# EAGLE design ftdiusb (EAGLE 9.6.1)
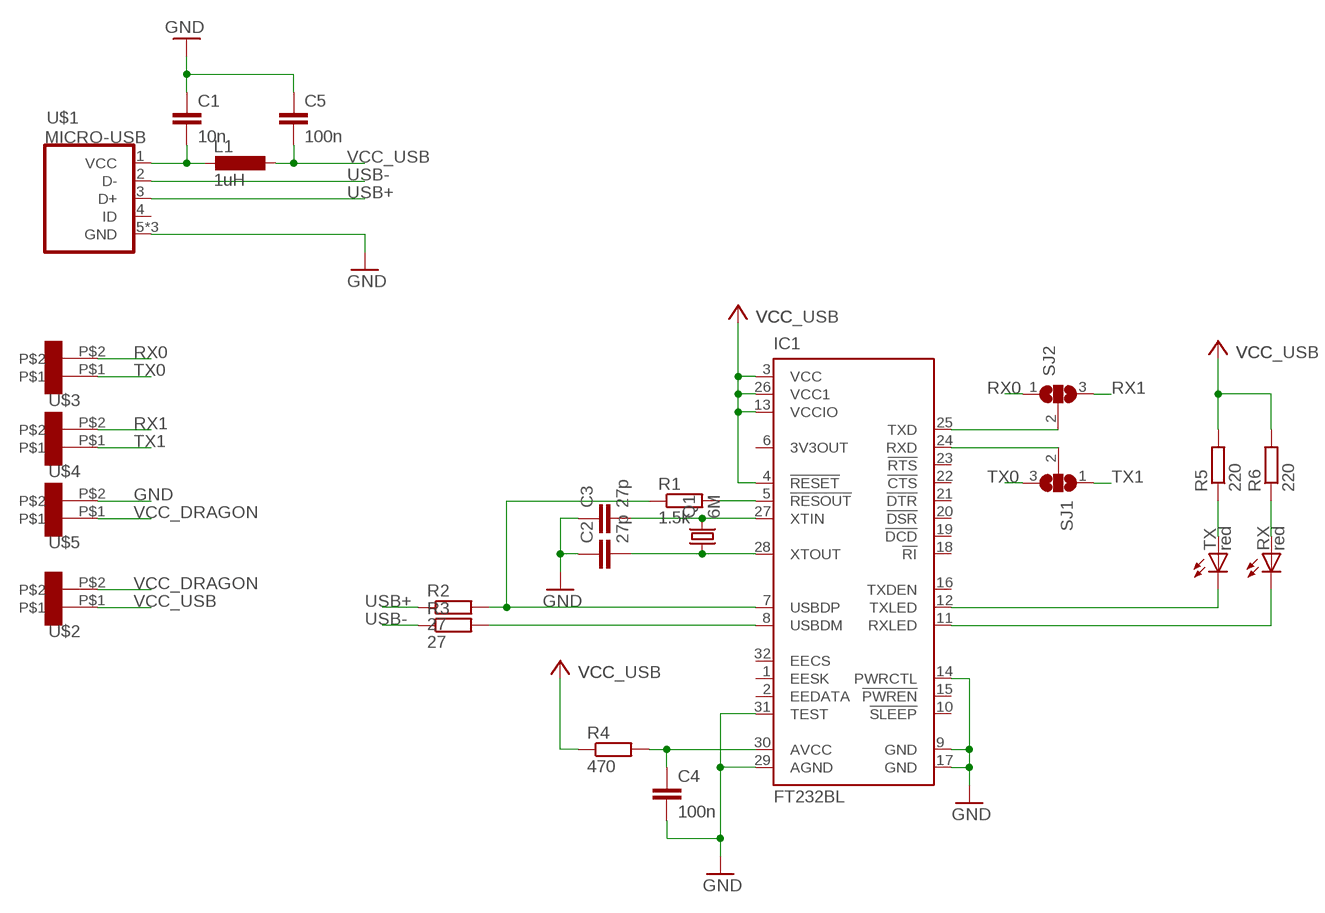
[diagram p0: schematic, sheet 1]

## Parts
C1  10n  C-EUC0603  [C0603]
C2  27p  C-EUC0603  [C0603]
C3  27p  C-EUC0603  [C0603]
C4  100n  C-EUC0603  [C0603]
C5  100n  C-EUC0603  [C0603]
IC1  FT232BL  [LQFP32-7X7]
L1  1uH  L-EUL0603  [L0603]
Q1  6M  CRYSTALHC49U-V  [HC49U-V]
R1  1.5k  R-EU_R0603  [R0603]
R2  27  R-EU_R0603  [R0603]
R3  27  R-EU_R0603  [R0603]
R4  470  R-EU_R0603  [R0603]
R5  220  R-EU_R0603  [R0603]
R6  220  R-EU_R0603  [R0603]
RX  red  LED_0603  [C0603]
SJ1  SJ2WW  [SJ_2W]
SJ2  SJ2WW  [SJ_2W]
TX  red  LED_0603  [C0603]
U$1  MICRO-USB  [MICRO-USB]
U$2  CON_DIL_2  [CON_DIL_2]
U$3  CON_DIL_2  [CON_DIL_2]
U$4  CON_DIL_2  [CON_DIL_2]
U$5  CON_DIL_2  [CON_DIL_2]

## Nets
GND: C1.1 C2.1 C3.1 C4.2 C5.1 IC1.9(GND) IC1.14(PWRCTL) IC1.17(GND) IC1.29(AGND) IC1.31(TEST) U$1.5(GND) U$1.GND1(GND) U$1.GND2(GND) U$5.P$2
N$1: IC1.5(!RESOUT) R1.2
N$2: IC1.7(USBDP) R1.1 R2.2
N$3: IC1.8(USBDM) R3.2
N$4: C1.2 L1.2 U$1.1(VCC)
N$5: IC1.25(TXD) SJ2.2
N$6: C3.2 IC1.27(XTIN) Q1.2
N$7: C2.2 IC1.28(XTOUT) Q1.1
N$8: IC1.24(RXD) SJ1.2
N$9: IC1.12(TXLED) TX.N
N$10: R5.1 TX.P
N$11: C4.1 IC1.30(AVCC) R4.2
N$12: R6.1 RX.P
N$13: IC1.11(RXLED) RX.N
RX0: SJ2.1 U$3.P$2
RX1: SJ2.3 U$4.P$2
TX0: SJ1.3 U$3.P$1
TX1: SJ1.1 U$4.P$1
USB+: R2.1 U$1.3(D+)
USB-: R3.1 U$1.2(D-)
VCC_DRAGON: U$2.P$2 U$5.P$1
VCC_USB: C5.2 IC1.3(VCC) IC1.4(!RESET) IC1.13(VCCIO) IC1.26(VCC1) L1.1 R4.1 R5.2 R6.2 U$2.P$1 ; supply symbol labelled VCC
Unconnected: IC1.1(EESK) IC1.2(EEDATA) IC1.6(3V3OUT) IC1.10(!SLEEP) IC1.15(!PWREN) IC1.16(TXDEN) IC1.18(!RI) IC1.19(!DCD) IC1.20(!DSR) IC1.21(!DTR) IC1.22(!CTS) IC1.23(!RTS) IC1.32(EECS) U$1.4(ID)

## Library data of the parts
C1-C5 = rcl:C-EU: CAPACITOR, European symbol; SPICEPREFIX: C
IC1 = ftdichip:FT232B: USB to serial UART interface Source: DS_FT232BL_BQ.pdf; MF: FARNELL; MPN: FT232BL/TR; OC_FARNELL: unknown; OC_NEWARK: 38K1551
L1 = rcl-2:L-EU: INDUCTOR, European symbol
Q1 = crystal:CRYSTAL: CRYSTAL; OC_FARNELL: 1666969; OC_NEWARK: unknown
R1-R6 = rcl:R-EU_: RESISTOR, European symbol; SPICEPREFIX: R
RX TX = led:LED_0603
SJ1 SJ2 = jumper:SJ2W: SMD solder JUMPER
U$1 = microusb:MICRO-USB: Micro USB B connector
U$2-U$5 = connector:CON_DIL_2

## Board
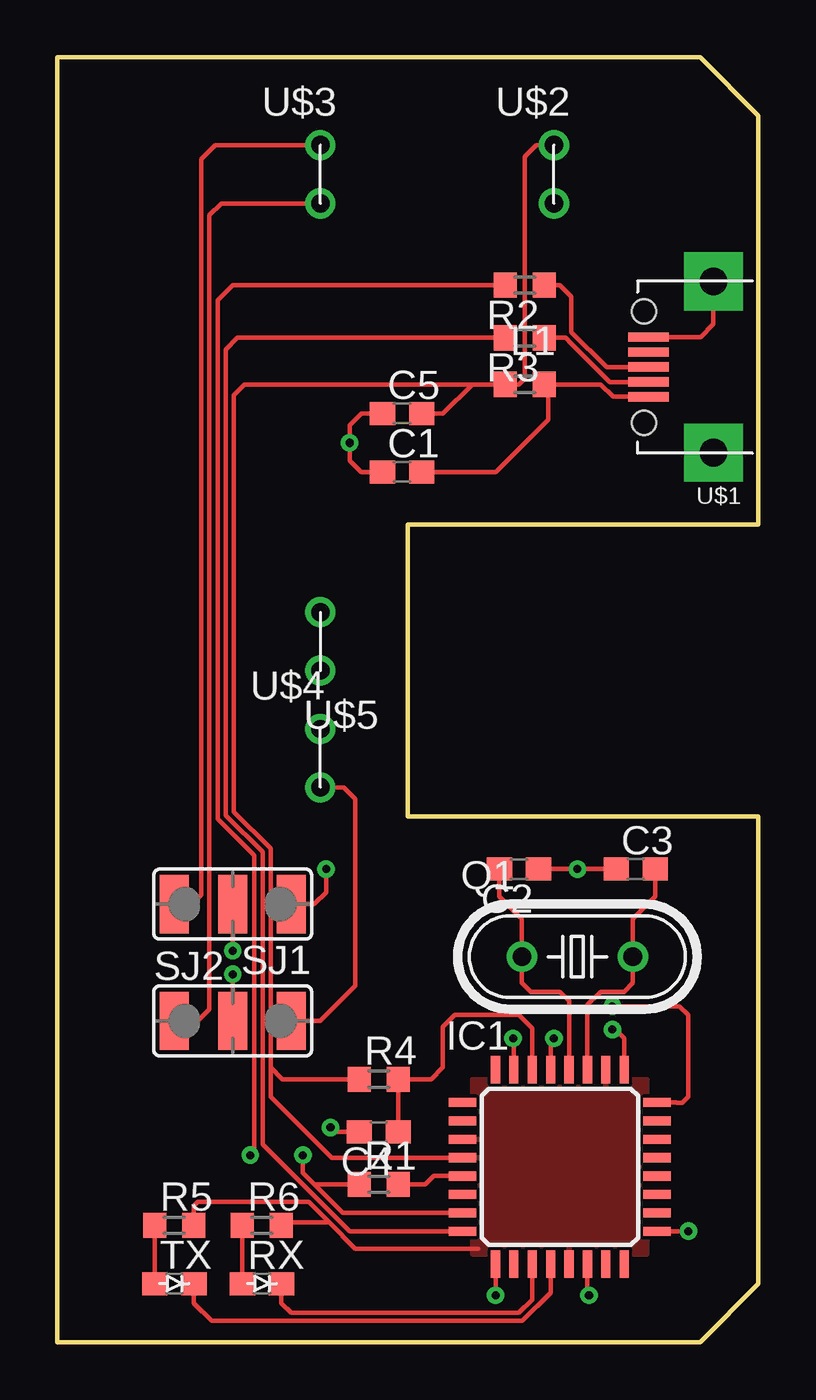
[diagram p1: board, top side]
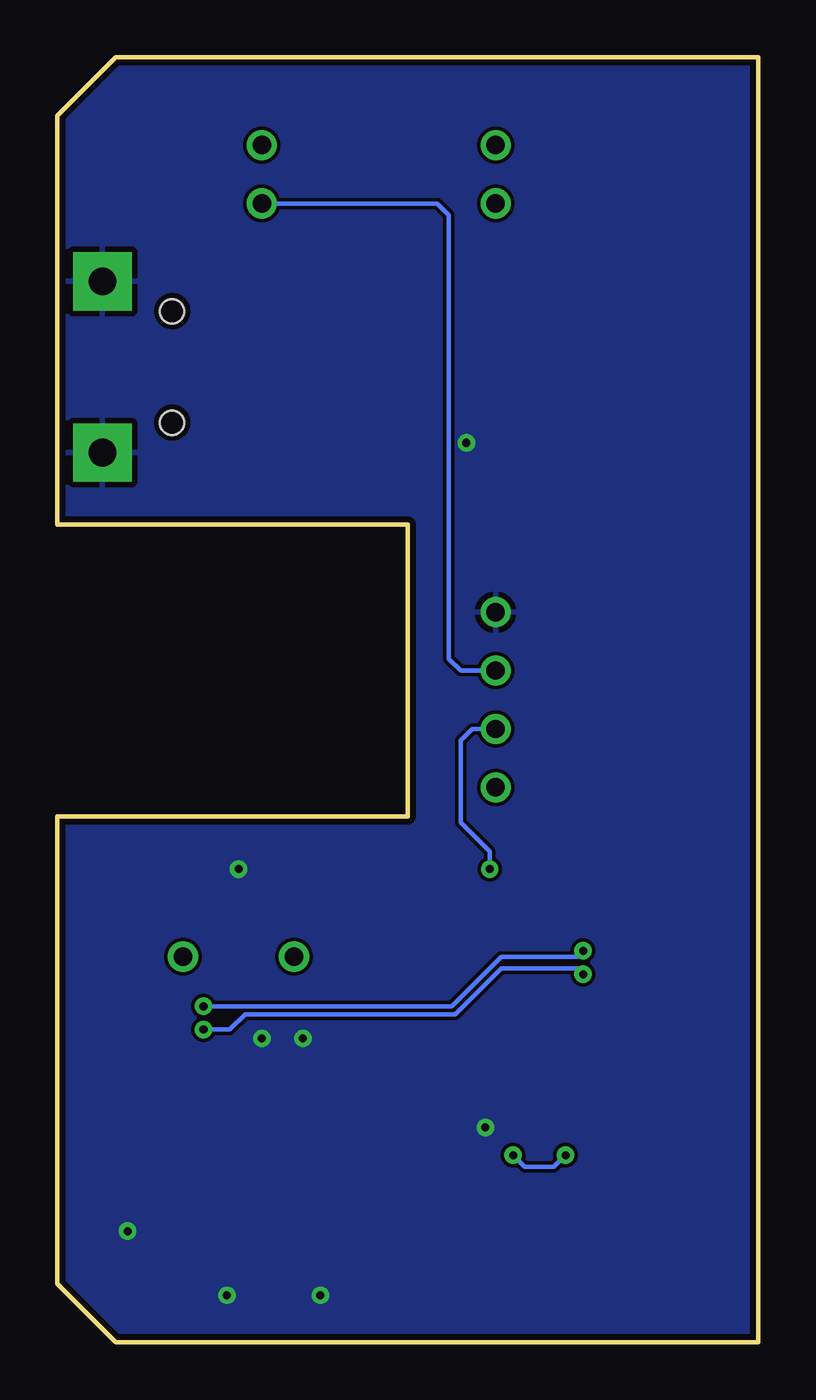
[diagram p2: board, bottom side, seen from below]

Size 30.48 x 55.88 mm. Coordinates in mm from the lower left corner, seen from the top.
Outline: 0,0 27.94,0 30.48,2.54 30.48,22.86 15.24,22.86 15.24,35.56 30.48,35.56 30.48,53.34 27.94,55.88 0,55.88 0,0
Copper layers (1*16): Top 0.035mm / dielectric 1.5mm / Bottom 0.035mm
Design rules "default *": minimum track width 6mil, minimum drill 0.35mm, track to track 6mil, track to pad 6mil, pad to pad 6mil, via to via 6mil, smd to smd 6mil, copper to edge 10mil, drill to drill 6mil, minimum pad ring 10mil, minimum via ring 8mil, stop-mask expansion 4mil, vias tented up to drill 0mil, thermal gap 10mil

### Footprints (pad centres in the part's own frame; a part is rotated, then mirrored left to right if it is on the bottom)
C0603 = smd 1.1 x 1: 1 -0.85,0; 2 0.85,0
LQFP32-7X7 = smd 1.2 x 0.4: 1 -4.225,2.8; 2 -4.225,2; 3 -4.225,1.2; 4 -4.225,0.4; 5 -4.225,-0.4; 6 -4.225,-1.2; 7 -4.225,-2; 8 -4.225,-2.8; 17 4.225,-2.8; 18 4.225,-2; 19 4.225,-1.2; 20 4.225,-0.4; 21 4.225,0.4; 22 4.225,1.2; 23 4.225,2; 24 4.225,2.8 | smd 0.4 x 1.2: 9 -2.8,-4.225; 10 -2,-4.225; 11 -1.2,-4.225; 12 -0.4,-4.225; 13 0.4,-4.225; 14 1.2,-4.225; 15 2,-4.225; 16 2.8,-4.225; 25 2.8,4.225; 26 2,4.225; 27 1.2,4.225; 28 0.4,4.225; 29 -0.4,4.225; 30 -1.2,4.225; 31 -2,4.225; 32 -2.8,4.225
L0603 = smd 1 x 1.1: 1 -0.85,0; 2 0.85,0
HC49U-V = drill 0.813: 1 -2.413,0; 2 2.413,0
R0603 = smd 1 x 1.1: 1 -0.85,0; 2 0.85,0
C0603' = smd 1.1 x 1: N 0.85,0; P -0.85,0
SJ_2W = smd 1.27 x 2.54: 1 -2.54,0; 2 0,0; 3 2.54,0
MICRO-USB = smd 0.4 x 1.75: 1 -1.3,4.525; 2 -0.65,4.525; 3 0,4.525; 4 0.65,4.525; 5 1.3,4.525 | drill 1.2 pad 2.54 square: GND1 -3.725,1.7; GND2 3.725,1.7 | hole 1.05: -2.425,4.73; 2.425,4.73
CON_DIL_2 = drill 0.8: P$1 0,2.54; P$2 0,0

### Placement (x,y rotation side)
C1  14.99,37.85 0 top
C2  20.07,20.57 180 top
C3  25.15,20.57 0 top
C4  13.97,9.14 180 top
C5  14.99,40.39 0 top
IC1  21.84,7.62 0 top
L1  20.32,41.66 0 top
Q1  22.61,16.76 0 top
R1  13.97,6.86 0 top
R2  20.32,45.97 180 top
R3  20.32,43.69 180 top
R4  13.97,11.43 0 top
R5  5.08,5.08 0 top
R6  8.89,5.08 0 top
RX  red  [C0603']  8.89,2.54 0 top
SJ1  7.62,19.05 180 top
SJ2  7.62,13.97 0 top
TX  red  [C0603']  5.08,2.54 0 top
U$1  30.23,42.42 90 top
U$2  21.59,49.53 0 top
U$3  11.43,49.53 0 top
U$4  11.43,24.13 0 top
U$5  11.43,31.75 180 top

### Tracks (layer width: path | path; a pad name or v marks a point on that pad's centre or on a via)
GND  (via drill 0.35)
  Top 0.203: C3.1 v22.61,20.57 C2.1 | U$1.5 27.97,43.72 28.53,44.27 U$1.GND2 | IC1.9 v19.05,2.03 | IC1.14 23.04,2.1 v23.11,2.03 | IC1.17 v27.43,4.83 | C4.2 12.06,9.14 v11.87,9.33 | IC1.31 19.84,13.18 v19.81,13.21 | IC1.29 21.44,13.06 v21.59,13.21 | C5.1 13.21,40.39 12.7,39.88 v12.7,39.12 12.7,38.35 13.21,37.85 C1.1
  pour Bottom: 0,55.88 0,0 30.48,0 30.48,55.88
N$1
  Top 0.203: IC1.5 16.36,7.22 16,6.86 R1.2
N$2  (via drill 0.35)
  Top 0.203: R2.2 7.62,45.97 6.96,45.32 6.96,22.76 8.56,21.16 8.56,8.31 v8.38,8.13 | IC1.7 12.41,5.62 11.18,6.86 | 11.18,6.86 10.67,7.37 v10.67,8.13 | R1.1 11.18,6.86
  Bottom 0.203: v8.38,8.13 8.89,7.62 10.16,7.62 v10.67,8.13
N$3
  Top 0.203: R3.2 7.82,43.69 7.31,43.18 7.31,22.92 8.91,21.32 8.91,8.61 12.71,4.82 IC1.8
N$4
  Top 0.203: 21.34,41.66 23.62,41.66 24.16,41.12 U$1.1 | 21.34,41.66 L1.2 | 21.34,41.66 21.34,40.13 19.05,37.85 C1.2
N$5  (via drill 0.35)
  Top 0.203: IC1.25 24.64,13.21 24.25,13.59 v24.13,13.59 | SJ2.2 v7.62,16
  Bottom 0.203: v24.13,13.59 22.98,13.59 22.32,14.25 13.21,14.25 13.18,14.25 11.18,16.26 7.87,16.26 v7.62,16
N$6
  Top 0.203: C3.2 26,19.39 25.02,18.42 Q1.2 25.02,15.62 24.64,15.24 23.62,15.24 23.04,14.66 IC1.27
N$7
  Top 0.203: C2.2 19.22,19.39 20.19,18.42 Q1.1 20.19,15.62 20.57,15.24 21.84,15.24 22.24,14.84 IC1.28
N$8  (via drill 0.35)
  Top 0.203: IC1.24 26.92,10.42 26.92,10.41 27.18,10.41 27.43,10.67 27.43,14.22 27.05,14.61 v24.13,14.61 | v7.62,17.02 SJ1.2
  Bottom 0.203: v24.13,14.61 13.33,14.61 11.18,16.76 7.87,16.76 v7.62,17.02
N$9
  Top 0.203: TX.N 5.93,1.69 6.71,0.91 20.21,0.91 21.44,2.15 IC1.12
N$10
  Top 0.203: R5.1 TX.P
N$11
  Top 0.203: C4.1 R4.2 16.26,11.43 16.76,11.94 16.76,13.72 17.27,14.22 20.07,14.22 20.64,13.65 IC1.30
N$12
  Top 0.203: R6.1 RX.P
N$13
  Top 0.203: RX.N 9.74,1.69 10.16,1.27 20.07,1.27 20.64,1.85 IC1.11
RX0
  Top 0.203: U$3.P$2 7.11,49.53 6.6,49.02 6.6,14.48 6.1,13.97 SJ2.1
RX1
  Top 0.203: SJ2.3 11.43,13.97 12.95,15.49 12.95,23.62 12.45,24.13 U$4.P$2
TX0
  Top 0.203: U$3.P$1 6.86,52.07 6.25,51.46 6.25,19.46 5.84,19.05 SJ1.3
TX1  (via drill 0.35)
  Top 0.203: SJ1.1 11.18,19.05 11.68,19.56 v11.68,20.57
  Bottom 0.203: U$4.P$1 12.45,26.67 12.95,26.16 12.95,22.61 11.68,21.34 v11.68,20.57
USB+
  Top 0.203: U$1.3 23.88,42.42 22.35,43.94 22.35,45.47 21.84,45.97 R2.1
USB-
  Top 0.203: U$1.2 24.01,41.77 22.35,43.43 22.1,43.69 R3.1
VCC_DRAGON
  Bottom 0.203: U$2.P$2 13.97,49.53 13.46,49.02 13.46,29.72 12.95,29.21 U$5.P$1
VCC_USB
  Top 0.203: C5.2 16.76,40.39 18.03,41.66 | 18.03,41.66 L1.1 20.07,41.66 20.32,41.91 20.32,51.56 20.83,52.07 U$2.P$1 | R5.2 5.93,5.93 6.1,6.1 10.93,6.1 11.81,5.21 | 18.29,4.06 12.96,4.06 11.81,5.21 | R6.2 9.87,5.21 11.81,5.21 | IC1.4 11.92,8.02 9.27,10.67 9.27,11.94 | 9.27,11.94 9.27,21.46 7.67,23.06 7.67,41.2 8.13,41.66 18.03,41.66 | 9.27,11.94 9.78,11.43 R4.1
  pour Top: 18.29,11.43 25.65,11.43 25.65,3.81 18.03,3.81 18.03,11.43

### Text on the board
Document: TX0 | VCC OUT | RX0 | GND | VCC | TX1 | RX1 | TX0 | TX1 | RX0 | RX1 | TX | RX